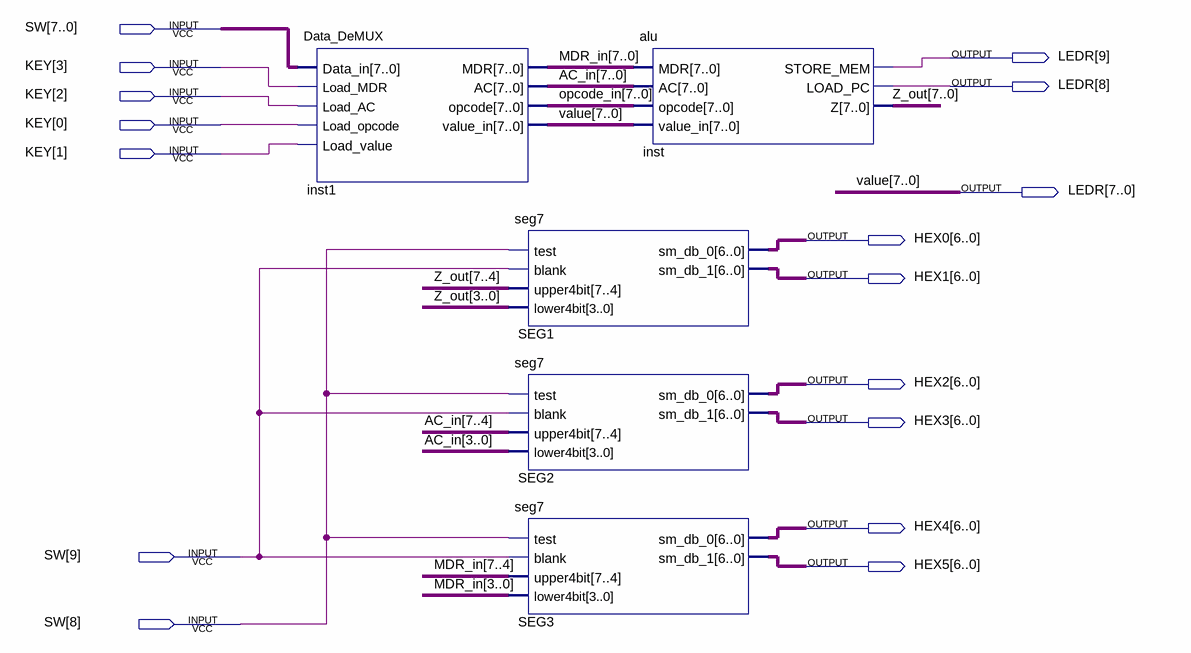
[diagram p0: schematic sheet]
// Quartus schematic alu_tb.bdf as structural Verilog: 5 symbols, 16 pins
module alu_tb (
  input  [9:0] SW,
  input  [3:0] KEY,
  output [9:0] LEDR,
  output [6:0] HEX0,
  output [6:0] HEX1,
  output [6:0] HEX2,
  output [6:0] HEX3,
  output [6:0] HEX4,
  output [6:0] HEX5
);

  wire [7:0] AC_in, MDR_in, opcode_in, Z_out;

  Data_DeMUX inst1 (
    .Data_in(SW[7:0]), .Load_MDR(KEY[3]), .Load_AC(KEY[2]), .Load_opcode(KEY[0]), .Load_value(KEY[1]),
    .MDR(MDR_in), .AC(AC_in), .opcode(opcode_in), .value_in(LEDR[7:0]));
  seg7 SEG1 (
    .test(SW[8]), .blank(SW[9]), .upper4bit(Z_out[7:4]), .lower4bit(Z_out[3:0]), .sm_db_0(HEX0),
    .sm_db_1(HEX1));
  seg7 SEG2 (
    .test(SW[8]), .blank(SW[9]), .upper4bit(AC_in[7:4]), .lower4bit(AC_in[3:0]), .sm_db_0(HEX2),
    .sm_db_1(HEX3));
  seg7 SEG3 (
    .test(SW[8]), .blank(SW[9]), .upper4bit(MDR_in[7:4]), .lower4bit(MDR_in[3:0]), .sm_db_0(HEX4),
    .sm_db_1(HEX5));
  alu inst (
    .MDR(MDR_in), .AC(AC_in), .opcode(opcode_in), .value_in(LEDR[7:0]), .STORE_MEM(LEDR[9]),
    .LOAD_PC(LEDR[8]), .Z(Z_out));

  // Other names for the same wires on the sheet: value[7:0] = LEDR[7:0]
endmodule
